# EAGLE schematic test-jauge (EAGLE 6.5.0)
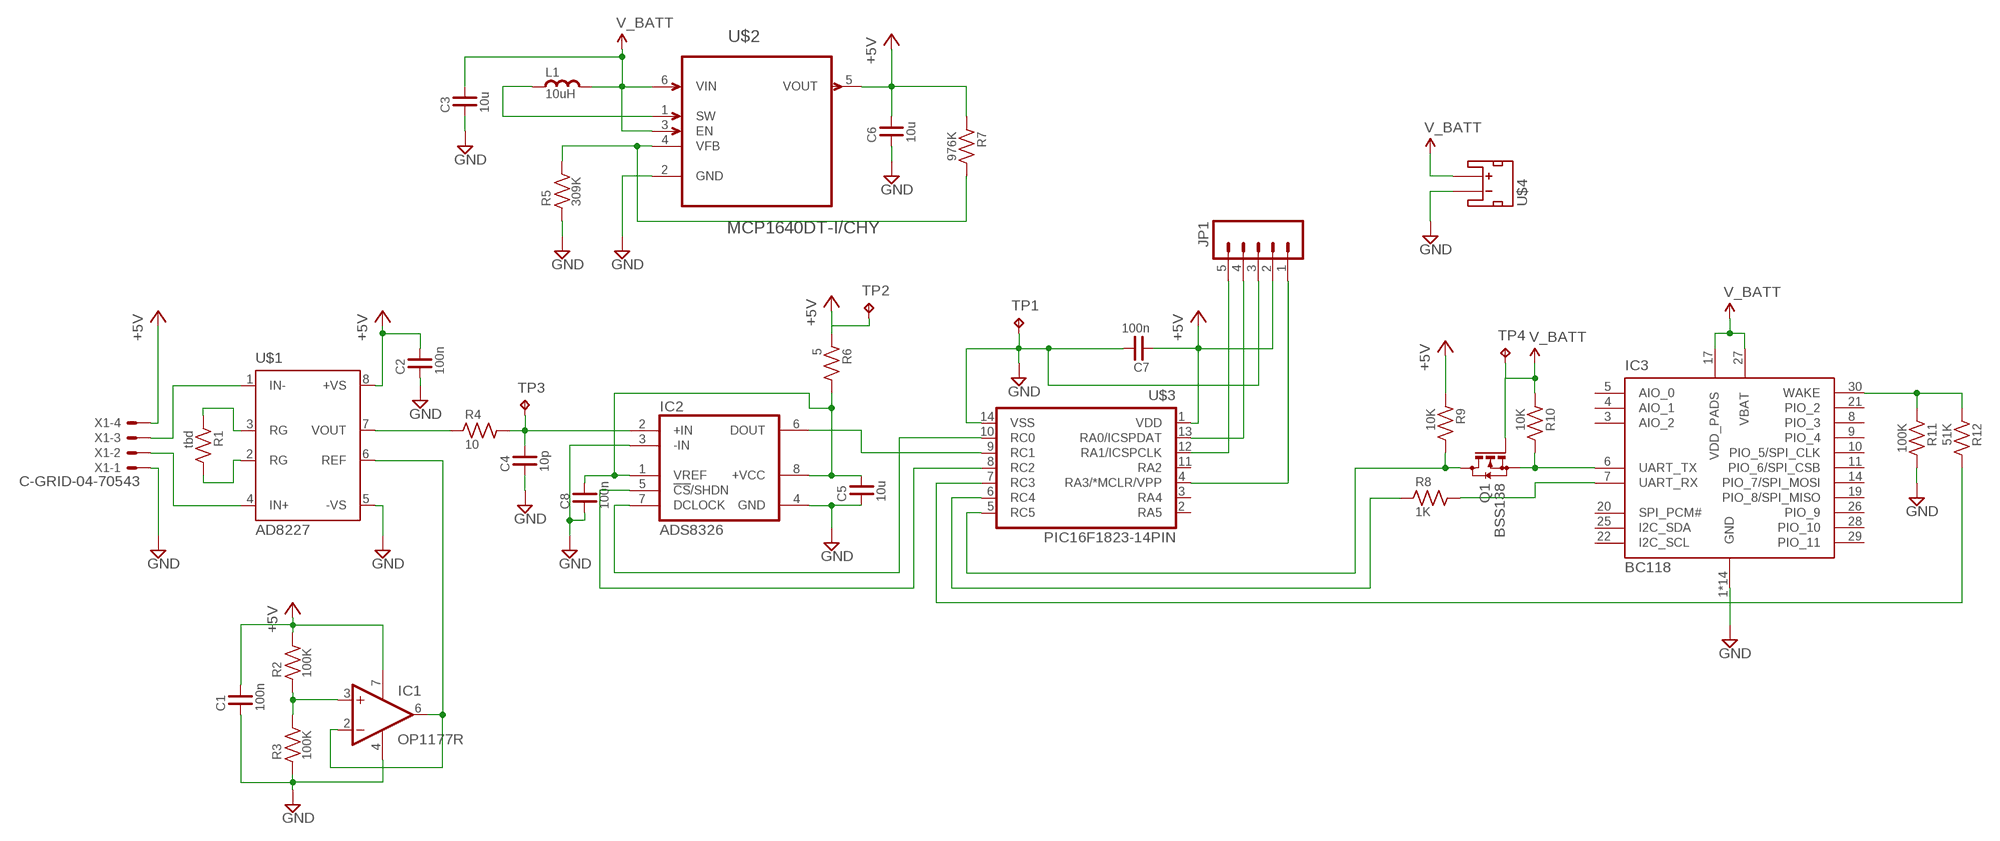
[diagram p0: schematic, sheet 1]

## Parts
C1  100n  C1206  [C1206]
C2  100n  C1206  [C1206]
C3  10u  C1206  [C1206]
C4  10p  C1206  [C1206]
C5  10u  C1206  [C1206]
C6  10u  C1206  [C1206]
C7  100n  C1206  [C1206]
C8  100n  C1206  [C1206]
IC1  OP1177R  [SOIC8]
IC2  ADS8326  ADS7816E  [MSOP08]
IC3  BC118  [BC118]
JP1  M05PTH  [1X05]
L1  10uH  LU1206  [L1206]
Q1  BSS138  BSS123  [SOT23]
R1  tbd  RU1206  [R1206]
R2  100K  RU1206  [R1206]
R3  100K  RU1206  [R1206]
R4  10  RU1206  [R1206]
R5  309K  RU1206  [R1206]
R6  5  RU1206  [R1206]
R7  976K  RU1206  [R1206]
R8  1K  RU1206  [R1206]
R9  10K  RU1206  [R1206]
R10  10K  RU1206  [R1206]
R11  100K  RU1206  [R1206]
R12  51K  RU1206  [R1206]
TP1  TPTP08R  [TP08R]
TP2  TPTP08R  [TP08R]
TP3  TPTP08R  [TP08R]
TP4  TPTP08R  [TP08R]
U$1  AD8227  AD822X  [SO8]
U$2  MCP1640DT-I/CHY  [SOT95P270X145-6N]
U$3  PIC16F1823-14PIN  [SOIC-14]
U$4  JST-2-PTH  [JST-2-PTH]
X1  C-GRID-04-70543  [70543-04]

## Nets
+5V: C1.2 C2.2 C6.2 C7.1 IC1.7(V+) JP1.2 R2.2 R6.1 R7.1 R9.1 TP2.TP U$1.8(+VS) U$2.5(VOUT) U$3.1(VDD) X1.4
GND: C1.1 C2.1 C3.1 C4.1 C5.1 C6.1 C7.2 C8.1 IC1.4(V-) IC2.3(-IN) IC2.4(GND) IC3.1(GND) IC3.2(GND) IC3.12(GND) IC3.13(GND) IC3.15(GND) IC3.16(GND) IC3.18(GND) IC3.23(GND) IC3.24(GND) IC3.31(GND) IC3.32(GND) IC3.33(GND) IC3.34(GND) IC3.35(GND) JP1.3 R3.1 R5.1 R11.2 TP1.TP U$1.5(-VS) U$2.2(GND) U$3.14(VSS) U$4.- X1.1
N$1: C5.2 C8.2 IC2.1(VREF) IC2.8(+VCC) R6.2
N$2: U$1.1(IN-) X1.3
N$3: R4.1 U$1.7(VOUT)
N$4: C4.2 IC2.2(+IN) R4.2 TP3.TP
N$5: U$1.4(IN+) X1.2
N$6: IC1.3(+IN) R2.1 R3.2
N$7: IC1.2(-IN) IC1.6(OUT) U$1.6(REF)
N$8: IC2.6(DOUT) U$3.9(RC1)
N$9: IC2.7(DCLOCK) U$3.10(RC0)
N$10: IC2.5(!CS!/SHDN) U$3.8(RC2)
N$11: JP1.4 U$3.13(RA0/ICSPDAT)
N$12: JP1.5 U$3.12(RA1/ICSPCLK)
N$13: JP1.1 U$3.4(RA3/*MCLR/VPP)
N$14: IC3.6(UART_TX) Q1.2(S) R10.2
N$15: R12.2 U$3.7(RC3)
N$16: Q1.3(D) R9.2 U$3.5(RC5)
N$17: R8.1 U$3.6(RC4)
N$18: IC3.7(UART_RX) R8.2
N$19: IC3.30(WAKE) R11.1 R12.1
N$21: R1.1 U$1.3(RG)
N$22: R1.2 U$1.2(RG)
N$59: L1.1 U$2.1(SW)
N$61: R5.2 R7.2 U$2.4(VFB)
V_BATT: C3.2 IC3.17(VDD_PADS) IC3.27(VBAT) L1.2 Q1.1(G) R10.1 TP4.TP U$2.3(EN) U$2.6(VIN) U$4.+
Unconnected: IC3.3(AIO_2) IC3.4(AIO_1) IC3.5(AIO_0) IC3.8(PIO_3) IC3.9(PIO_4) IC3.10(PIO_5/SPI_CLK) IC3.11(PIO_6/SPI_CSB) IC3.14(PIO_7/SPI_MOSI) IC3.19(PIO_8/SPI_MISO) IC3.20(SPI_PCM#) IC3.21(PIO_2) IC3.22(I2C_SCL) IC3.25(I2C_SDA) IC3.26(PIO_9) IC3.28(PIO_10) IC3.29(PIO_11) U$3.2(RA5) U$3.3(RA4) U$3.11(RA2)

## Library data of the parts
C1-C8 = divers:C: Capacitor bipolar
IC1 = linear:OP1177: Precision Low Noise, Low Input Bias Current Operational Amplifiers Source: OP1177_2177_4177.pdf
IC2 = burr-brown:ADS7816: 12-Bit High Speed Micro Power Sampling ADC; MF: TEXAS INSTRUMENT CONNECTORS; MPN: ADS7816EC/250; OC_FARNELL: 1754724; OC_NEWARK: 74C7108
IC3 = blue-creation-bc118:BC118: BC118 is a highly flexible, ultra low power, small form factor Bluetooth Version 4.0 Certified module. Bluetooth Certified 4.0 Audio module  Single Mode: Bluetooth Low Energy (BLE)  Embedded Bluetooth Protocol Stack  Supports GATT Profile, Audio, Proximity, and iBeacon  Supports I2C and UART transparent Data Modes  Simple UART and GPIO interface for command and control  Small form factor (14.4mm x 19.3mm x 2.2mm)  Bluetooth, FCC and CE certified The library has been designed by Richard Magdycz <https://www.facebook.com/groups/eaglecadsoftUK>
JP1 = SparkFun-Connectors:M05: Header 5 Standard 5-pin 0.1" header. Use with straight break away headers (SKU : PRT-00116), right angle break away headers (PRT-00553), swiss pins (PRT-00743), machine pins (PRT-00117), and female headers (PRT-00115). Molex polarized connector foot print use with SKU : PRT-08230 with associated crimp pins and housings.
L1 = divers:LU: Coil, US symbol
Q1 = transistor-small-signal:BSS123: N-CHANNEL MOS FET
R1-R12 = divers:RU: Resistor, US symbol
TP1-TP4 = testpad:TP: Test pad
U$1 = analog-devices:AD822X
U$2 = Microchip_By_element14_Batch_1:MCP1640DT-I/CHY: Synchronous Boost Regulator; MPN: MCP1640DT-I/CHY; OC_FARNELL: 1800209; OC_NEWARK: 73R3627; PACKAGE: SOT-6; SUPPLIER: Microchip
U$3 = SparkFun-DigitalIC:PIC16F1823-14PIN
U$4 = SparkFun:JST-2-PTH
X1 = con-molex:C-GRID-04: CONNECTOR wire to board 2.54 mm (0.100") pitch header; OC_FARNELL: unknown; OC_NEWARK: unknown